# Altium schematic sheet WAKEUP.SchDoc
size A4
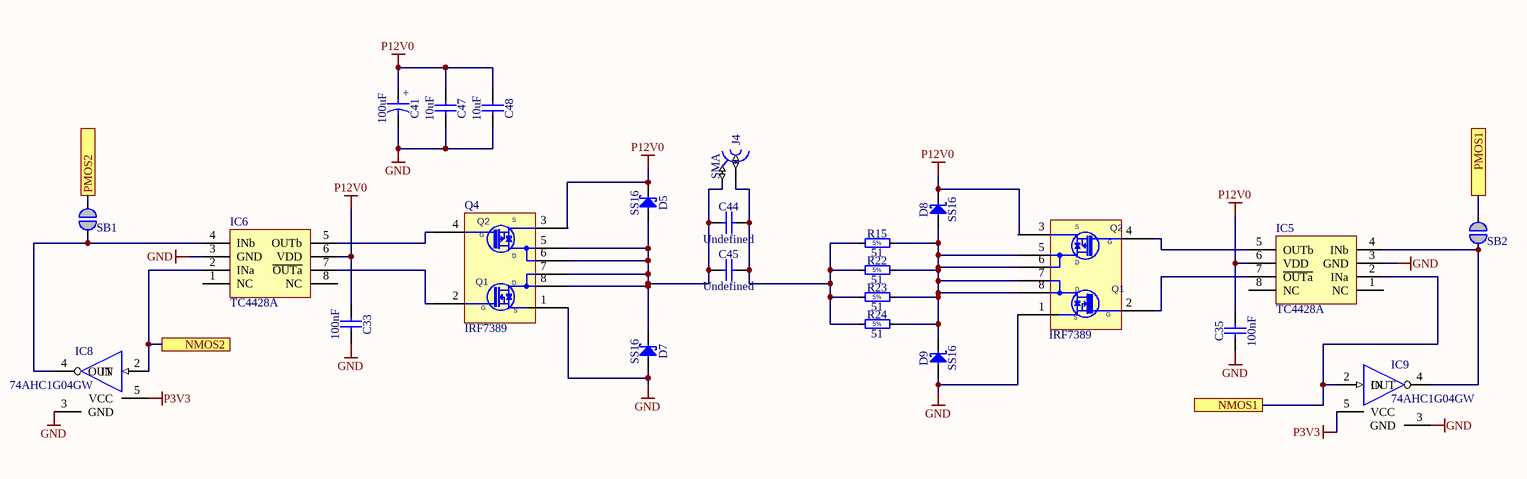
[diagram p0: WAKEUP.SchDoc]

## Parts
C33  100nF  [CAPC1608X87N]
C35  100nF  [CAPC1608X87N]
C41  100uF  [CAPAE660X540N]
C44  Undefined  [CAPC2012X135N]
C45  Undefined  [CAPC2012X135N]
C47  10uF  [CAPC3216X140N]
C48  10uF  [CAPC3216X140N]
D5  SS16  [DIOM5127X229N]
D7  SS16  [DIOM5127X229N]
D8  SS16  [DIOM5127X229N]
D9  SS16  [DIOM5127X229N]
IC5  TC4428A  [SO-8]
IC6  TC4428A  [SO-8]
IC8  74AHC1G04GW  [SOT65P212X110-5N]
IC9  74AHC1G04GW  [SOT65P212X110-5N]
J4  SMA  [HUBER-SUHNER_85_SMA-50-0-101/111_NE]
Q4  IRF7389  [SO-8]
Q5  IRF7389  [SO-8]
R15  51  [RESC6331X80N]
R22  51  [RESC6331X80N]
R23  51  [RESC6331X80N]
R24  51  [RESC6331X80N]
SB1  Solderbridge  [Solderbridge]  (value not drawn)  (no BOM)
SB2  Solderbridge  [Solderbridge]  (value not drawn)  (no BOM)

## Ports
NMOS1, NMOS2, PMOS1, PMOS2

## Nets
GND: C33.1 C35.1 C41.2 C47.2 C48.2 D7.2(A) D9.2(A) IC5.3(GND) IC6.3(GND) IC8.3(GND) IC9.3(GND) Q4.1(S-N) Q5.1(S-N)
P3V3: IC8.5(VCC) IC9.5(VCC)  [also labelled VDD]
P12V0: C33.2 C35.2 C41.1 C47.1 C48.1 D5.1(C) D8.1(C) IC5.6(VDD) IC6.6(VDD) Q4.3(S-P) Q5.3(S-P)
NMOS1: IC5.2(INa) IC9.2(IN) ; port NMOS1
NMOS2: IC6.2(INa) IC8.2(IN) ; port NMOS2
PMOS1: SB2.1 ; port PMOS1
PMOS2: SB1.1 ; port PMOS2
NetC44_1: C44.1 C45.1 D5.2(A) D7.1(C) J4.2 Q4.5(D-P) Q4.6(D-P) Q4.7(D-N) Q4.8(D-N)
NetC44_2: C44.2 C45.2 J4.1 R15.1 R22.1 R23.1 R24.1
NetD8_2: D8.2(A) D9.1(C) Q5.5(D-P) Q5.6(D-P) Q5.7(D-N) Q5.8(D-N) R15.2 R22.2 R23.2 R24.2
NetIC5_4: IC5.4(INb) IC9.4(OUT) SB2.2
NetIC5_5: IC5.5(OUTb) Q5.4(G-P)
NetIC5_7: IC5.7(~{OUTa}) Q5.2(G-N)
NetIC6_4: IC6.4(INb) IC8.4(OUT) SB1.2
NetIC6_5: IC6.5(OUTb) Q4.4(G-P)
NetIC6_7: IC6.7(~{OUTa}) Q4.2(G-N)

Not connected (* = marked no-connect by the designer): IC5 1(NC) 8(NC); IC6 1(NC) 8(NC)

## Notes on the sheet
- (in symbol CAE660-540_100UF_16V_20%) +
- (in symbol IRF7389) S; Q2; G; D; Q1
- (in symbol R2512_51R_5%_2W_200PPM_BOURNS_CRM2512) 5%

## Library data of the parts
C33 C35 = CC0603_100NF_50V_10%_X7R: Non-polarised capacitor; Part Description: SMD Multilayer Chip Ceramic Capacitor; Manufacturer: GENERIC; Manufacturer1 Part Number: 223858615649; Voltage: 50V; TC: X7R; Tolerance: ±10%; Part Number: CC0603_100NF_50V_10%_X7R; Component Kind: Standard; Component Type: Standard; Pin Count: 2; Value: 100nF; Status: Preferred; Manufacturer Part Number: CC0603_100NF_50V_10%_X7R; Case: 0603; Mounted: Yes; Socket: No; SMD: Yes; Sense: No; Manufacturer1 Example: PHYCOMP; Manufacturer1 ComponentHeight: 0.87mm; HelpURL: \\cern.ch\dfs\Applications\Altium\Datasheets\CC0603_X7R_PHYCOMP.pdf; Author: CERN DEM JLC; CreateDate: 2007-12-03; LatestRevisionDate: 2007-12-03
C41 = CAE660-540_100UF_16V_20%: Polarised capacitor; Part Description: Aluminum Electrolytic SMT Capacitor; Manufacturer: PANASONIC; Manufacturer Part Number: EEEFK1C101AP; Voltage: 16V; Tolerance: ±20%; Part Number: CAE660-540_100UF_16V_20%; Component Kind: Standard; Component Type: Standard; Pin Count: 2; Value: 100uF; Status: Not Recommended; Case: D; Mounted: Yes; Socket: No; SMD: Yes; Sense: No; ComponentHeight: 5.8mm; HelpURL: \\cern.ch\dfs\Applications\Altium\Datasheets\CAE_PANASONIC_FK.pdf; Author: CERN DEM JLC; CreateDate: 2007-12-03; LatestRevisionDate: 2014-11-05
C44 C45 = CC0805_NO-VALUE: Non-polarised capacitor; Part Description: Reserved Footprint For 0805(2012) Chip Ceramic Capacitor; Mounted: No; Part Number: CC0805_NO-VALUE; Component Kind: Standard; Component Type: Standard; Pin Count: 2; Value: Undefined; Status: None; Manufacturer: Undefined; Manufacturer Part Number: CC0805_NO-VALUE; Case: 0805; Socket: No; SMD: Yes; Sense: No; Manufacturer1 ComponentHeight: 1.35mm; HelpURL: Undefined; Author: CERN DEM JLC; CreateDate: 10.12.2008; LatestRevisionDate: 11.09.2013
C47 C48 = CC1206_10UF_16V_10%_X7R: Non-polarised capacitor; Part Description: SMD Multilayer Chip Ceramic Capacitor; Manufacturer: GENERIC; Manufacturer1 Part Number: C1206C106K4RAC; Voltage: 16V; TC: X7R; Tolerance: ±10%; Part Number: CC1206_10UF_16V_10%_X7R; Component Kind: Standard; Component Type: Standard; Pin Count: 2; Value: 10uF; Status: Preferred; Manufacturer Part Number: CC1206_10uF_16V_10%_X7R; Case: 1206; Mounted: Yes; Socket: No; SMD: Yes; Sense: No; Manufacturer1 Example: KEMET; Manufacturer1 ComponentHeight: 1.8mm; HelpURL: \\cern.ch\dfs\Applications\Altium\Datasheets\CC1206_X7R_KEMET.pdf; Author: CERN DEM JLC; CreateDate: 2009-04-28; LatestRevisionDate: 2009-04-28
D5 D7-D9 = SS16: Schottky Diode; Part Description: Surface Mount Schottky Barrier Rectifier; Manufacturer: VISHAY GENERAL SEMICONDUCTOR; Voltage: 60V; Power: 1A; PressFit: No; Bonding: No; Part Number: SS16; Component Kind: Standard; Component Type: Standard; Device: SS16; PackageDescription: DO-214-AC Molded Diode, Body 5.1x2.7mm, IPC Medium Density; Manufacturer Part Number: SS16; Pin Count: 2; Case: DO-214AC; Mounted: Yes; Socket: No; SMD: Yes; Sense: No; ComponentHeight: 2.29mm; HelpURL: \\cern.ch\dfs\Applications\Altium\Datasheets\SS16.pdf; Author: CERN DEM JLC; CreateDate: 15.07.2008; LatestRevisionDate: 23.08.2010
IC5 IC6 = DRV_TC4428A: MOSFET Driver
IC8 IC9 = 74AHC1G04GW: Single Inverter Buffer; Manufacturer: NXP SEMICONDUCTORS; PressFit: No; Bonding: No; Part Number: 74AHC1G04GW; Component Kind: Standard; Component Type: Standard; Device: 74AHC1G04GW; PackageDescription: SOT353, SOT, 0.65mm Pitch, 5 pin, 1.25mm W X 2.05mm L X 1.10mm H, IPC Medium Density; Part Description: Single Inverter Buffer; Manufacturer Part Number: 74AHC1G04GW; Pin Count: 3; Case: SOT353; Mounted: Yes; Socket: No; SMD: Yes; Sense: No; ComponentHeight: 1.1mm; Author: CERN DEM JLC; HelpURL: \\cern.ch\dfs\Applications\Altium\Datasheets\74AHC1G04GW.pdf; CreateDate: 2010-03-03; LatestRevisionDate: 2010-03-03
J4 = HUBER-SUHNER_85_SMA-50-0-101/111_NE: Part Description: SMA 50 Ohms Right Angle PCB Jack; Manufacturer: HUBER+SUHNER; PressFit: No; Part Number: HUBER-SUHNER_85_SMA-50-0-101/111_NE; Component Kind: Standard; Component Type: Standard; Footprint: HUBER-SUHNER_85 SMA-50-0-101/111_NE; Pin Count: 2; Family: SMA; Mounted: Yes; Socket: No; SMD: No; Sense: No; Status: None; Manufacturer Part Number: 85_SMA-50-0-101/111_NE; ComponentHeight: 9.6mm; HelpURL: \\cern.ch\dfs\Applications\Altium\Datasheets\HUBER-SUHNER_85_SMA-50-0-101-111_NE.pdf; Author: CERN DEM JLC; CreateDate: 2010-04-20; LatestRevisionDate: 2014-11-06
R15 R22-R24 = R2512_51R_5%_2W_200PPM_BOURNS_CRM2512: Resistor - 5%; Part Description: Pulse Resistant Power Thick Film Chip Resistor; Manufacturer: BOURNS; Manufacturer Part Number: CRM2512-JW-510ELF; Power: 2W; TC: ±200ppm/°C; Part Number: R2512_51R_5%_2W_200PPM_BOURNS_CRM2512; Component Kind: Standard; Component Type: Standard; Pin Count: 2; Value: 51; Status: None; Tolerance: ±5%; Case: 2512; Mounted: Yes; Sense: No; Socket: No; SMD: Yes; ComponentHeight: 0.8mm; HelpURL: \\cern.ch\dfs\Applications\Altium\Datasheets\R2512_BOURNS_CRM2512.pdf; Author: CERN DEM JLC; CreateDate: 2012-01-10; LatestRevisionDate: 2012-01-10
SB1 SB2 = SOLDERBRIDGE: Artikkelnr Noca: N.A.; Part Number: Solderbridge; Manufacturer: *; Manufacturer Part Number: *; Datasheet: *; LatestRevisionDate: 2009-12-14; Pin Count: 2; Publisher: Nordic Semiconductor; Published: 2009-12-14; Value: Solderbridge; Note: *; Supplier: *; Supplier part number: *; 2nd source Supplier: *; 2nd source part number: *; Footprint Doc: Solderbridge; Artikkelnr Simpro: N.A.